# Altium schematic sheet M2 Breakout.SchDoc
size B
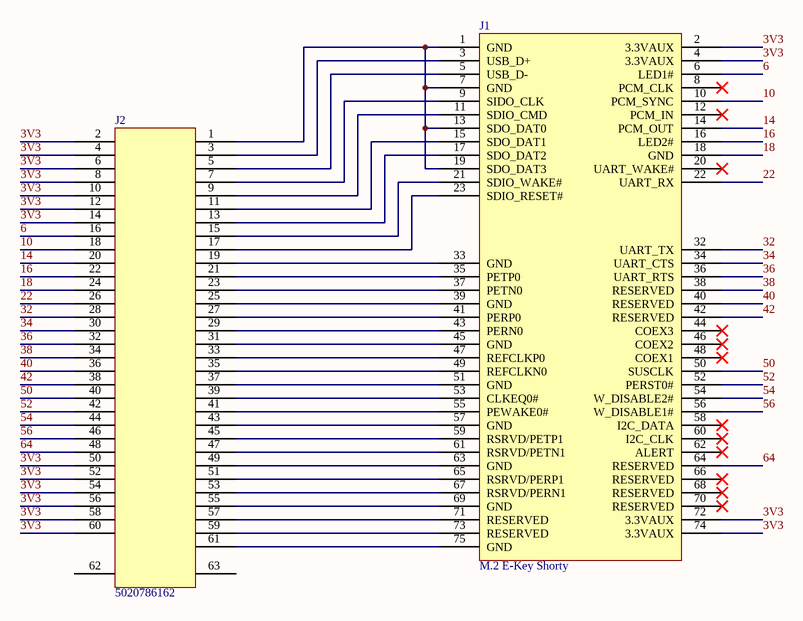
[diagram p0: M2 Breakout.SchDoc]

## Parts
J1  M.2 E-Key Shorty  [M.2 E-Key Shorty]
J2  5020786162  [5020786162]

## Nets
3V3: J1.2(3.3VAUX) J1.4(3.3VAUX) J1.72(3.3VAUX) J1.74(3.3VAUX) J2.2 J2.4 J2.6 J2.8 J2.10 J2.12 J2.14 J2.50 J2.52 J2.54 J2.56 J2.58 J2.60
6: J1.6(LED1#) J2.16
10: J1.10(PCM_SYNC) J2.18
14: J1.14(PCM_OUT) J2.20
16: J1.16(LED2#) J2.22
18: J1.18(GND) J2.24
22: J1.22(UART_RX) J2.26
32: J1.32(UART_TX) J2.28
34: J1.34(UART_CTS) J2.30
36: J1.36(UART_RTS) J2.32
38: J1.38(RESERVED) J2.34
40: J1.40(RESERVED) J2.36
42: J1.42(RESERVED) J2.38
50: J1.50(SUSCLK) J2.40
52: J1.52(PERST0#) J2.42
54: J1.54(W_DISABLE2#) J2.44
56: J1.56(W_DISABLE1#) J2.46
64: J1.64(RESERVED) J2.48
NetJ1_1: J1.1(GND) J1.7(GND) J1.13(SDO_DAT0) J1.19(SDO_DAT3) J2.1
NetJ1_3: J1.3(USB_D+) J2.3
NetJ1_5: J1.5(USB_D-) J2.5
NetJ1_9: J1.9(SIDO_CLK) J2.7
NetJ1_11: J1.11(SDIO_CMD) J2.9
NetJ1_15: J1.15(SDO_DAT1) J2.11
NetJ1_17: J1.17(SDO_DAT2) J2.13
NetJ1_21: J1.21(SDIO_WAKE#) J2.15
NetJ1_23: J1.23(SDIO_RESET#) J2.17
NetJ1_33: J1.33(GND) J2.19
NetJ1_35: J1.35(PETP0) J2.21
NetJ1_37: J1.37(PETN0) J2.23
NetJ1_39: J1.39(GND) J2.25
NetJ1_41: J1.41(PERP0) J2.27
NetJ1_43: J1.43(PERN0) J2.29
NetJ1_45: J1.45(GND) J2.31
NetJ1_47: J1.47(REFCLKP0) J2.33
NetJ1_49: J1.49(REFCLKN0) J2.35
NetJ1_51: J1.51(GND) J2.37
NetJ1_53: J1.53(CLKEQ0#) J2.39
NetJ1_55: J1.55(PEWAKE0#) J2.41
NetJ1_57: J1.57(GND) J2.43
NetJ1_59: J1.59(RSRVD/PETP1) J2.45
NetJ1_61: J1.61(RSRVD/PETN1) J2.47
NetJ1_63: J1.63(GND) J2.49
NetJ1_65: J1.65(RSRVD/PERP1) J2.51
NetJ1_67: J1.67(RSRVD/PERN1) J2.53
NetJ1_69: J1.69(GND) J2.55
NetJ1_71: J1.71(RESERVED) J2.57
NetJ1_73: J1.73(RESERVED) J2.59
NetJ1_75: J1.75(GND) J2.61

Not connected (* = marked no-connect by the designer): J1 8(PCM_CLK)* 12(PCM_IN)* 20(UART_WAKE#)* 44(COEX3)* 46(COEX2)* 48(COEX1)* 58(I2C_DATA)* 60(I2C_CLK)* 62(ALERT)* 66(RESERVED)* 68(RESERVED)* 70(RESERVED)*; J2 62 63

## Library data of the parts
J2 = 5020786162: Conn FPC Connector SKT 61 POS 0.25mm Solder RA SMD T/R